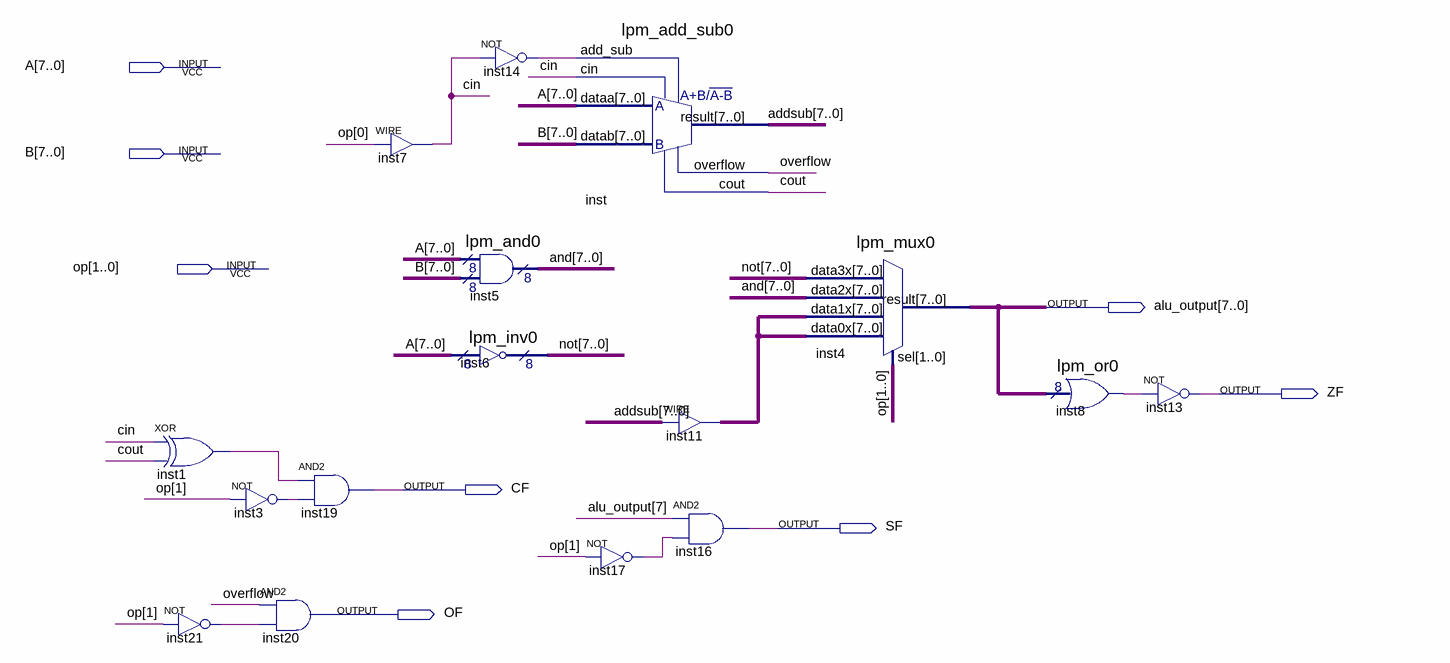
[diagram p0: schematic sheet]
// Quartus schematic test_alu.bdf as structural Verilog: 16 symbols, 8 pins
module test_alu (
  input  [7:0] A,
  input  [7:0] B,
  input  [1:0] op,
  output [7:0] alu_output,
  output ZF,
  output CF,
  output SF,
  output OF
);

  wire cin, cout, inst1_out, inst3_out, inst8_result, inst14_out, inst17_out, inst21_out, overflow;
  wire [7:0] addsub, \and , inst11_out, \not ;

  xor inst1 (inst1_out, cin, cout);
  not inst21 (inst21_out, op[1]);
  not inst3 (inst3_out, op[1]);
  and inst19 (CF, inst1_out, inst3_out);
  and inst20 (OF, overflow, inst21_out);
  assign cin = op[0];  // WIRE inst7
  lpm_and0 inst5 (.data0x(A), .data1x(B), .result(\and ));
  lpm_inv0 inst6 (.data(A), .result(\not ));
  not inst14 (inst14_out, cin);
  lpm_add_sub0 inst (
    .dataa(A), .datab(B), .add_sub(inst14_out), .cin(cin), .result(addsub), .overflow(overflow), .cout(cout));
  not inst17 (inst17_out, op[1]);
  assign inst11_out = addsub;  // WIRE inst11
  and inst16 (SF, alu_output[7], inst17_out);
  lpm_mux0 inst4 (
    .data3x(\not ), .data2x(\and ), .data1x(inst11_out), .data0x(inst11_out), .sel(op), .result(alu_output));
  lpm_or0 inst8 (.data(alu_output), .result(inst8_result));
  not inst13 (ZF, inst8_result);
endmodule
